# Altium schematic sheet CAN.SchDoc
size A; SheetNumber: 5; SheetTotal: 6
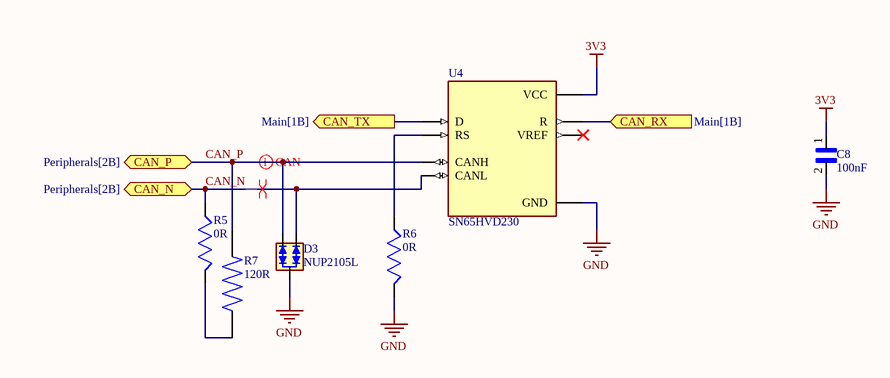
[diagram p0: CAN.SchDoc]

## Parts
C8  100nF  [CAPC2012X140N]
D3  NUP2105L  [SOT23]
R5  0R  [RESC2012X60]
R6  0R  [RESC2012X60]
R7  120R  [RESC2012X65N]
U4  SN65HVD230  [SOIC127P599X175-8N]

## Ports
CAN_N (bidir, see Peripherals[2B]), CAN_P (bidir, see Peripherals[2B]), CAN_RX (in, see Main[1B]), CAN_TX (out, see Main[1B])

## Nets
3V3: C8.1 U4.3(VCC)
GND: C8.2 D3.3(GND) R6.1 U4.2(GND)
CAN_N: D3.1(CANH) R5.2 U4.6(CANL) ; port CAN_N
CAN_P: D3.2(CANL) R7.2 U4.7(CANH) ; port CAN_P
CAN_RX: U4.4(R) ; port CAN_RX
CAN_TX: U4.1(D) ; port CAN_TX
NetR5_1: R5.1 R7.1
NetR6_2: R6.2 U4.8(RS)

Not connected (* = marked no-connect by the designer): U4 5(VREF)*

## Layout directives
differential pair: CAN_N, CAN_P

## Library data of the parts
C8 = 08055G104ZAT1A: CAPACITOR, 0805, 100NF, 50V; Capacitor Application:General Purpose; Dielectric Characteristic:Y5V; Capacitance:0.1ÂµF; Capacitance Tolerance:-20% to +80%; Voltage Rating:50V; Capacitor Case Style:0805; Capacitor Mounting:SMD; Operating Temperature Range:-25Â°C to +85Â°C; SVHC:No SVHC (15-Dec-2010); External Depth:0.95mm; External Length / Height:2mm; External Width:1.25mm; Insulation Resistance:10000Mohm; No. of Pins:2; Operating Temperature Max:85Â°C; Operating Temperature Min:-25Â°C; Package / Case:0805; Reel Quantity:3000; Tape Width:8mm; Temperature Coefficient:+22%, -82%; Terminal Type:Surface Mount (SMD, SMT); Termination Type:SMD; Tolerance +:80%; Tolerance -:20%; Voltage Rating VDC:50V; MF: {'manufacturer': u'AVX'}; Package: None; Availability: Unavailable; Value: *; MP: 08055G104ZAT1A; Price: None
D3 = NUP2105L: MF: {'manufacturer': u'Diotec Semiconductor'}; Value: *; MP: NUP2105L; Availability: Unavailable; Package: None; Price: None
R5 R6 = RC0805JR-7W0RL: RC Series 0805 0.125 W 2 kOhms 5% Â±100 ppm/Â°C SMT Thick Film Chip Resistor; MF: {'manufacturer': u'Yageo'}; Package: None; MP: RC0805JR-7W0RL; Value: *; Price: None; Availability: Unavailable
R7 = 1-2176327-4: Fixed Resistor CRGP 0805 120R 1%; MF: {'manufacturer': u'TE Connectivity'}; Package: None; MP: 1-2176327-4; Value: *; Price: None; Availability: Unavailable
U4 = SN65HVD230: the sn65hvd230 sn65hvd231 and sn65hvd232 controller area network (can) transceivers are designed for use with the tex...; MF: {'manufacturer': u'Texas Instruments'}; Value: *; Package: None; MP: SN65HVD230; Availability: Unavailable; Price: None